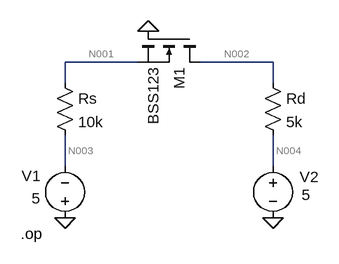
[diagram p0: schematic Draft3.asc]
Draft3.asc, the LTspice schematic file:
Version 4
SHEET 1 880 680
WIRE 128 192 16 192
WIRE 336 192 224 192
WIRE 16 224 16 192
WIRE 336 224 336 192
WIRE 16 352 16 304
WIRE 336 352 336 304
FLAG 144 144 0
FLAG 16 432 0
FLAG 336 432 0
DATAFLAG 16 192 ""
DATAFLAG 320 192 ""
SYMBOL nmos 224 144 R90
SYMATTR InstName M1
SYMATTR Value BSS123
SYMBOL res 0 208 R0
SYMATTR InstName Rs
SYMATTR Value 10k
SYMBOL res 320 208 R0
SYMATTR InstName Rd
SYMATTR Value 5k
SYMBOL voltage 16 448 R180
WINDOW 0 37 81 Left 2
WINDOW 3 38 46 Left 2
SYMATTR InstName V1
SYMATTR Value 5
SYMBOL voltage 336 336 R0
WINDOW 0 41 33 Left 2
WINDOW 3 44 60 Left 2
SYMATTR InstName V2
SYMATTR Value 5
TEXT -52 456 Left 2 !.op

The netlist it stands for:
* Draft3.asc
M1 N002 0 N001 N001 BSS123
Rs N001 N003 10k
Rd N002 N004 5k
V1 0 N003 5
V2 N004 0 5
.model NMOS NMOS
.model PMOS PMOS
.lib standard.mos
.op
.backanno
.end

* Results of the author's LTspice run, read from the files saved beside the schematic
* Operating Point:
*   V(n002) = 3.241 V
*   V(n001) = -1.481 V
*   V(n003) = -5 V
*   V(n004) = 5 V
*   Id(M1) = 351.9 µA
*   Ig(M1) = -20.48 pA
*   Is(M1) = -351.9 µA
*   I(Rs) = 351.9 µA
*   I(Rd) = -351.9 µA
*   I(V1) = -351.9 µA
*   I(V2) = -351.9 µA